# Altium project DAC_Expansion_Board_Project.PrjPcb
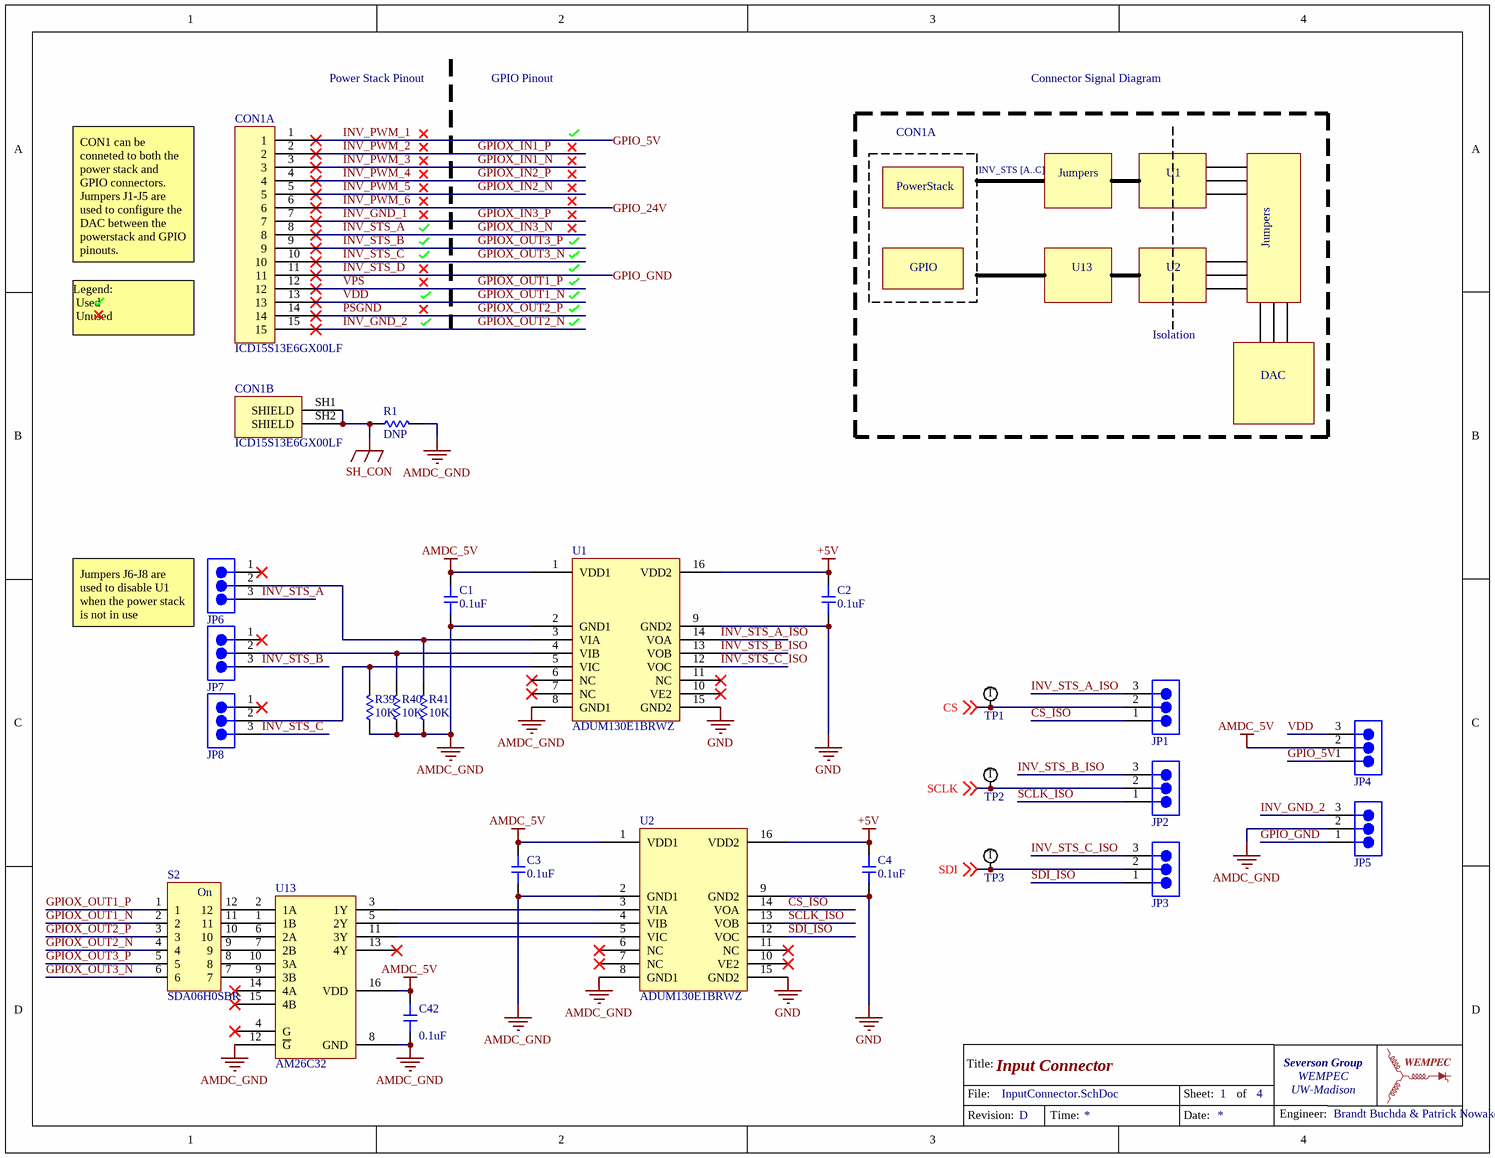
[diagram p0: InputConnector.SchDoc]
ProjectGroup: Severson Group; ProjectOrganization: WEMPEC; ProjectRev: D; ProjectUniversity: UW-Madison
4 sheets, 138 parts. Net scope: global (net labels, ports and power ports of the same name join across sheets).
Board file: PCB.PcbDoc
Sheets:
  InputConnector.SchDoc
  DAC.SchDoc
  OutputConnectors.SchDoc
  BackPage.SchDoc

## Sheet InputConnector.SchDoc: Input Connector
size Letter; Engineer: Brandt Buchda & Patrick Nowakowski; Revision: C; SheetTotal: 4; SheetNumber: 1

### Parts
C1  value 0.1uF  [0603-CAP]  (hidden comment: CC0603KRX7R8BB104)
C2  value 0.1uF  [0603-CAP]  (hidden comment: CC0603KRX7R8BB104)
C3  value 0.1uF  [0603-CAP]  (hidden comment: CC0603KRX7R8BB104)
C4  value 0.1uF  [0603-CAP]  (hidden comment: CC0603KRX7R8BB104)
C42  value 0.1uF  [0603-CAP]  (hidden comment: CC0603KRX7R8BB104)
CON1  ICD15S13E6GX00LF  [ICD15S13E6GX00LF]  (parts A,B of 2)
JP1  TSW-103-07-F-S  [PIN_HEADER_1X3]  (value not drawn)
JP2  TSW-103-07-F-S  [PIN_HEADER_1X3]  (value not drawn)
JP3  TSW-103-07-F-S  [PIN_HEADER_1X3]  (value not drawn)
JP4  TSW-103-07-F-S  [PIN_HEADER_1X3]  (value not drawn)
JP5  TSW-103-07-F-S  [PIN_HEADER_1X3]  (value not drawn)
JP6  TSW-103-07-F-S  [PIN_HEADER_1X3]  (value not drawn)
JP7  TSW-103-07-F-S  [PIN_HEADER_1X3]  (value not drawn)
JP8  TSW-103-07-F-S  [PIN_HEADER_1X3]  (value not drawn)
R1  value DNP  [0603-RES]  (hidden comment: Resistor)  (no BOM)
R39  value 10K  [0603-RES]  (hidden comment: ERJ-PB3B1002V)
R40  value 10K  [0603-RES]  (hidden comment: ERJ-PB3B1002V)
R41  value 10K  [0603-RES]  (hidden comment: ERJ-PB3B1002V)
S2  SDA06H0SBR  [SDA06H0SBR]
TP1  Test Point  [RCU-0C]  (value not drawn)
TP2  Test Point  [RCU-0C]  (value not drawn)
TP3  Test Point  [RCU-0C]  (value not drawn)
U1  ADUM130E1BRWZ  [SOIC127P1030X265-16N]
U2  ADUM130E1BRWZ  [SOIC127P1030X265-16N]
U13  AM26C32  [TSOP65P640X120-16N]

### Nets
+5V: C2.2 C4.2 U1.16(VDD2) U2.16(VDD2)
AMDC_5V: C1.2 C3.2 C42.2 JP4.2 U1.1(VDD1) U2.1(VDD1) U13.16(VDD)
AMDC_GND: C1.1 C3.1 C42.1 JP5.2 R1.2 R39.1 R40.1 R41.1 U1.2(GND1) U1.8(GND1) U2.2(GND1) U2.8(GND1) U13.8(GND) U13.12(~{G})
GND: C2.1 C4.1 U1.9(GND2) U1.15(GND2) U2.9(GND2) U2.15(GND2)
SH_CON: CON1.SH1(SHIELD) CON1.SH2(SHIELD) R1.1
CS: JP1.2 TP1.1 ; off-sheet CS
CS_ISO: JP1.1 U2.14(VOA)
GPIO_5V: CON1.1 JP4.1  [also labelled INV_PWM_1]
GPIO_24V: CON1.6  [also labelled INV_PWM_6]
GPIO_GND: CON1.11 JP5.1  [also labelled INV_STS_D]
GPIOX_IN1_N: CON1.3  [also labelled INV_PWM_3]
GPIOX_IN1_P: CON1.2  [also labelled INV_PWM_2]
GPIOX_IN2_N: CON1.5  [also labelled INV_PWM_5]
GPIOX_IN2_P: CON1.4  [also labelled INV_PWM_4]
GPIOX_IN3_N: CON1.8 JP6.3  [also labelled INV_STS_A]
GPIOX_IN3_P: CON1.7  [also labelled INV_GND_1]
GPIOX_OUT1_N: CON1.13 JP4.3 S2.2  [also labelled VDD]
GPIOX_OUT1_P: CON1.12 S2.1  [also labelled VPS]
GPIOX_OUT2_N: CON1.15 JP5.3 S2.4  [also labelled INV_GND_2]
GPIOX_OUT2_P: CON1.14 S2.3  [also labelled PSGND]
GPIOX_OUT3_N: CON1.10 JP8.3 S2.6  [also labelled INV_STS_C]
GPIOX_OUT3_P: CON1.9 JP7.3 S2.5  [also labelled INV_STS_B]
INV_STS_A_ISO: JP1.3 U1.14(VOA)
INV_STS_B_ISO: JP2.3 U1.13(VOB)
INV_STS_C_ISO: JP3.3 U1.12(VOC)
SCLK: JP2.2 TP2.1 ; off-sheet SCLK
SCLK_ISO: JP2.1 U2.13(VOB)
SDI: JP3.2 TP3.1 ; off-sheet SDI
SDI_ISO: JP3.1 U2.12(VOC)
NetJP6_2: JP6.2 R41.2 U1.3(VIA)
NetJP7_2: JP7.2 R40.2 U1.4(VIB)
NetJP8_2: JP8.2 R39.2 U1.5(VIC)
NetS2_7: S2.7 U13.9(3B)
NetS2_8: S2.8 U13.10(3A)
NetS2_9: S2.9 U13.7(2B)
NetS2_10: S2.10 U13.6(2A)
NetS2_11: S2.11 U13.1(1B)
NetS2_12: S2.12 U13.2(1A)
NetU2_3: U2.3(VIA) U13.3(1Y)
NetU2_4: U2.4(VIB) U13.5(2Y)
NetU2_5: U2.5(VIC) U13.11(3Y)

Not connected (* = marked no-connect by the designer): JP6 1(76)*; JP7 1(76)*; JP8 1(76)*; U1 6(NC)* 7(NC)* 10(VE2)* 11(NC)*; U2 6(NC)* 7(NC)* 10(VE2)* 11(NC)*; U13 4(G)* 13(4Y)* 14(4A)* 15(4B)*

### Notes on the sheet
- Power Stack Pinout
- GPIO Pinout
- Connector Signal Diagram
- CON1A
- PowerStack
- INV_STS [A..C]
- Jumpers
- U1
- CON1 can be conneted to both the power stack and GPIO connectors. Jumpers J1-J5 are used to configure the DAC between the powerstack and GPIO pinouts.
- GPIO
- U13
- U2
- Legend:
  Used
  Unused
- Isolation
- DAC
- Jumpers J6-J8 are used to disable U1 when the power stack is not in use
- Title:
- File:
- Sheet:
- of
- Revision:
- Time:
- Date:
- Engineer:
- (in symbol SDA06H0SBR) On
- (in symbol Test Point) T

### Library data of the parts
C1-C4 C42 = Capacitor 0.1uF: 0.1µF ±10% 25V Ceramic Capacitor X7R 0603 (1608 Metric); Supplier 1: Digi-Key; Supplier Part Number 1: 311-1341-1-ND
CON1 = ICD15S13E6GX00LF: 15 Position D-Sub, High Density Receptacle, Female Sockets Connector; Supplier Part Number 1: 609-2801-ND; Supplier 1: Digi-Key
JP1-JP8 = TSW-103-07-F-S: Connector Header Through Hole 3 position 0.100" (2.54mm); Supplier 1: Digi-Key; Supplier Part Number 1: SAM8995-ND
R1 = Resistor: DNP; Supplier 1: Digi-Key
R39-R41 = Resistor 10K: 10 kOhms ±0.1% 0.2W, 1/5W Chip Resistor 0603 (1608 Metric) Automotive AEC-Q200, Pulse Withstanding Thick Film; Supplier 1: Digi-Key; Supplier Part Number 1: P20086CT-ND
S2 = SDA06H0SBR: SWITCH SLIDE DIP SPST 25MA 24V; Supplier 1: Digi-Key; Supplier Part Number 1: CKN9495CT-ND
TP1-TP3 = Test Point: Material - Insulation: No Insulation; Supplier Part Number: *; Supplier: *; Footprint: *; Supplier 1: Digi-Key; RoHS: RoHS Compliant; Category: Test and Measurement; Stock 1: 136646; Pricing 1: 1=0.22, 10=0.206, 25=0.1756, 50=0.1536, 100=0.1426, 250=0.12616, 500=0.12068, 1000=0.09874 (USD); Packaging: Cut Tape (CT); Part Status: Active; Type: PC Test Point; Mounting Type: Surface Mount; Color: Natural; Size / Dimension: 0.063" x 0.031" x 0.045" (1.60mm x 0.80mm x 1.15mm); Plating: -; Material - Body: -; ComponentLink1URL: http://www.te.com/commerce/DocumentDelivery/DDEController?Action=srchrtrv&DocNm=1773266&DocType=DS&DocLang=English; ComponentLink1Description: http://www.te.com/commerce/DocumentDelivery/DDEController?Action=srchrtrv&DocNm=1773266&DocType=DS&DocLang=English; Supplier Part Number 1: A106145CT-ND
U1 U2 = ADUM130E1BRWZ: General Purpose Digital Isolator 3750Vrms 3 Channel 150Mbps 75kV/µs CMTI 16-SOIC (0.295", 7.50mm Width); Supplier 1: Digi-Key; Supplier Part Number 1: ADUM130E1BRWZ-ND
U13 = AM26C32: IC RCVR RS422 QUAD DIFF 16TSSOP; Supplier 1: Digi-Key; Supplier Part Number 1: 296-30088-1-ND

## Sheet DAC.SchDoc: DAC
size Letter; Engineer: Brandt Buchda; SheetNumber: 2; SheetTotal: 4
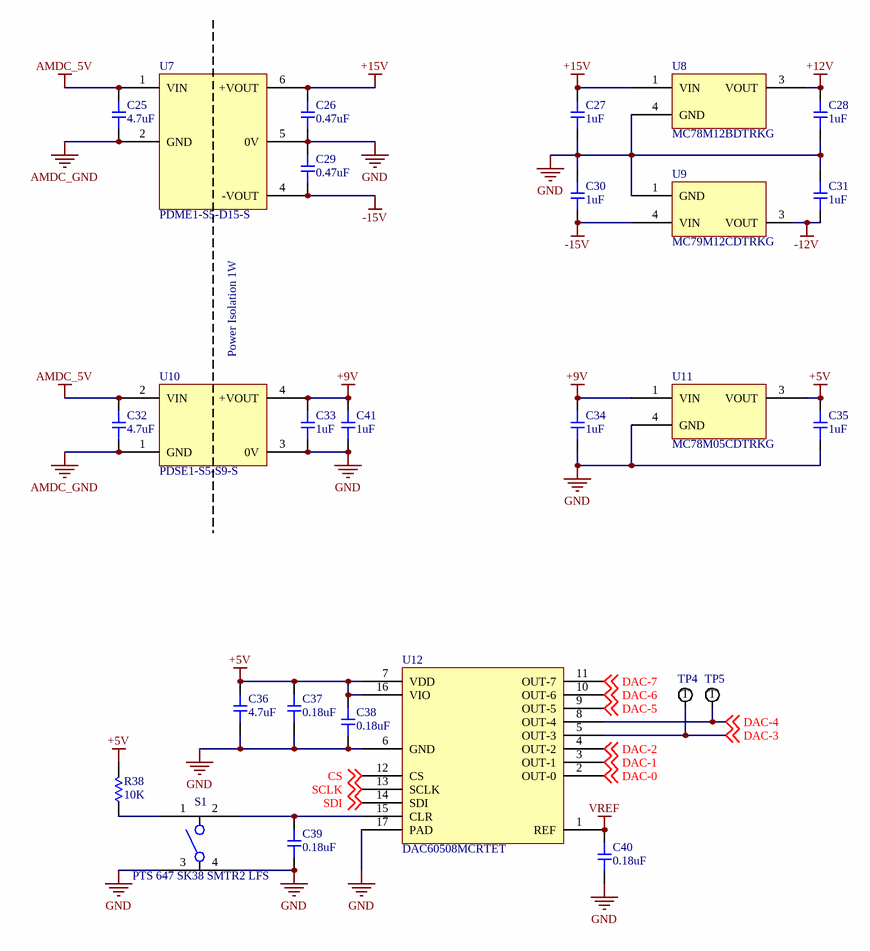
[diagram p1: DAC.SchDoc]

### Parts
C25  value 4.7uF  [0603-CAP]  (hidden comment: CL10A475KA8NQNC)
C26  value 0.47uF  [0603-CAP]  (hidden comment: CL10B474KO8NNNC)
C27  value 1uF  [0603-CAP]  (hidden comment: CL10A105KP8NNNC)
C28  value 1uF  [0603-CAP]  (hidden comment: CL10A105KP8NNNC)
C29  value 0.47uF  [0603-CAP]  (hidden comment: CL10B474KO8NNNC)
C30  value 1uF  [0603-CAP]  (hidden comment: CL10A105KP8NNNC)
C31  value 1uF  [0603-CAP]  (hidden comment: CL10A105KP8NNNC)
C32  value 4.7uF  [0603-CAP]  (hidden comment: CL10A475KA8NQNC)
C33  value 1uF  [0603-CAP]  (hidden comment: CL10A105KP8NNNC)
C34  value 1uF  [0603-CAP]  (hidden comment: CL10A105KP8NNNC)
C35  value 1uF  [0603-CAP]  (hidden comment: CL10A105KP8NNNC)
C36  value 4.7uF  [0603-CAP]  (hidden comment: CL10A475KA8NQNC)
C37  value 0.18uF  [0603-CAP]  (hidden comment: CC0603KRX7R7BB184)
C38  value 0.18uF  [0603-CAP]  (hidden comment: CC0603KRX7R7BB184)
C39  value 0.18uF  [0603-CAP]  (hidden comment: CC0603KRX7R7BB184)
C40  value 0.18uF  [0603-CAP]  (hidden comment: CC0603KRX7R7BB184)
C41  value 1uF  [0603-CAP]  (hidden comment: CL10A105KP8NNNC)
R38  value 10K  [0603-RES]  (hidden comment: ERJ-PB3B1002V)
S1  PTS 647 SK38 SMTR2 LFS  [PTS647SK38SMTR2LFSCT-ND]
TP4  Test Point  [RCU-0C]  (value not drawn)
TP5  Test Point  [RCU-0C]  (value not drawn)
U7  PDME1-S5-D15-S  [PDME1-S5-D15-S]
U8  MC78M12BDTRKG  [DPAK229P991X238-3N]
U9  MC79M12CDTRKG  [DPAK229P991X238-3N]
U10  PDSE1-S5-S9-S  [PDSE1-S5-S9-S]
U11  MC78M05CDTRKG  [DPAK229P991X238-3N]
U12  DAC60508MCRTET  [QFN50P300X300X80_HS-17N]

### Nets
+5V: C35.2 C36.2 C37.2 C38.2 R38.2 U11.3(VOUT) U12.7(VDD) U12.16(VIO)
+9V: C33.2 C34.2 C41.2 U10.4(+VOUT) U11.1(VIN)
+12V: C28.2 U8.3(VOUT)
+15V: C26.2 C27.2 U7.6(+VOUT) U8.1(VIN)
-12V: C31.1 U9.3(VOUT)
-15V: C29.1 C30.1 U7.4(-VOUT) U9.4(VIN)
AMDC_5V: C25.2 C32.2 U7.1(VIN) U10.2(VIN)
AMDC_GND: C25.1 C32.1 U7.2(GND) U10.1(GND)
GND: C26.1 C27.1 C28.1 C29.2 C30.2 C31.2 C33.1 C34.1 C35.1 C36.1 C37.1 C38.1 C39.1 C40.1 C41.1 S1.3 S1.4 U7.5(0V) U8.4(GND) U9.1(GND) U10.3(0V) U11.4(GND) U12.6(GND) U12.17(PAD)
VREF: C40.2 U12.1(REF)
CS: U12.12(CS) ; off-sheet CS
DAC-0: U12.2(OUT-0) ; off-sheet DAC-0
DAC-1: U12.3(OUT-1) ; off-sheet DAC-1
DAC-2: U12.4(OUT-2) ; off-sheet DAC-2
DAC-3: TP4.1 U12.5(OUT-3) ; off-sheet DAC-3
DAC-4: TP5.1 U12.8(OUT-4) ; off-sheet DAC-4
DAC-5: U12.9(OUT-5) ; off-sheet DAC-5
DAC-6: U12.10(OUT-6) ; off-sheet DAC-6
DAC-7: U12.11(OUT-7) ; off-sheet DAC-7
SCLK: U12.13(SCLK) ; off-sheet SCLK
SDI: U12.14(SDI) ; off-sheet SDI
NetC39_2: C39.2 S1.2 U12.15(CLR)
NetR38_1: R38.1 S1.1

### Notes on the sheet
- Power Isolation 1W
- Title:
- File:
- Sheet:
- of
- Revision:
- Time:
- Date:
- Engineer:
- (in symbol Test Point) T

### Library data of the parts
C25 C32 C36 = Capacitor 4.7uF: 4.7µF ±10% 25V Ceramic Capacitor X5R 0603 (1608 Metric); Supplier 1: Digi-Key; Supplier Part Number 1: 1276-1900-1-ND
C26 C29 = Capacitor .47uF: 0.47µF ±10% 16V Ceramic Capacitor X7R 0603 (1608 Metric); Supplier 1: Digi-Key; Supplier Part Number 1: 1276-1062-1-ND
C27 C28 C30 C31 C33-C35 C41 = Capacitor 1uF: 1µF ±10% 10V Ceramic Capacitor X5R 0603 (1608 Metric); Supplier 1: Digi-Key; Supplier Part Number 1: 1276-1182-1-ND
C37-C40 = Capacitor 0.18uF: 0.18µF ±10% 16V Ceramic Capacitor X7R 0603 (1608 Metric); Supplier 1: Digi-Key; Supplier Part Number 1: 311-4066-1-ND
R38 = Resistor 10K: as R39 on sheet InputConnector; Supplier 1: Digi-Key; Supplier Part Number 1: P20086CT-ND
S1 = PTS 647 SK38 SMTR2 LFS: Tactile Switch SPST-NO Top Actuated Surface Mount; Supplier 1: Digi-Key; Supplier Part Number 1: PTS647SK38SMTR2LFSCT-ND
TP4 TP5 = Test Point: Material - Insulation: No Insulation; Supplier Part Number: *; Supplier: *; Footprint: *; Supplier 1: Digi-Key; RoHS: RoHS Compliant; Category: Test and Measurement; Stock 1: 136646; Pricing 1: 1=0.22, 10=0.206, 25=0.1756, 50=0.1536, 100=0.1426, 250=0.12616, 500=0.12068, 1000=0.09874 (USD); Packaging: Cut Tape (CT); Part Status: Active; Type: PC Test Point; Mounting Type: Surface Mount; Color: Natural; Size / Dimension: 0.063" x 0.031" x 0.045" (1.60mm x 0.80mm x 1.15mm); Plating: -; Material - Body: -; ComponentLink1URL: http://www.te.com/commerce/DocumentDelivery/DDEController?Action=srchrtrv&DocNm=1773266&DocType=DS&DocLang=English; ComponentLink1Description: http://www.te.com/commerce/DocumentDelivery/DDEController?Action=srchrtrv&DocNm=1773266&DocType=DS&DocLang=English; Supplier Part Number 1: A106145CT-ND
U7 = PDME1-S5-D15-S: Isolated Module DC DC Converter 2 Output 15V -15V   34mA, 34mA 4.5V - 5.5V Input; Supplier 1: Digi-Key; Supplier Part Number 1: 102-6323-ND
U8 = MC78M12BDTRKG: +12 Linear Voltage Regulator IC  1 Output  500mA DPAK; Supplier 1: Digi-Key; Supplier Part Number 1: MC78M12BDTRKGOSCT-ND
U9 = MC79M12CDTRKG: -12 Linear Voltage Regulator IC  1 Output  500mA DPAK; Supplier 1: Digi-Key; Supplier Part Number 1: MC79M12CDTRKGOSCT-ND
U10 = PDSE1-S5-S9-S: Isolated Module DC DC Converter 1 Output 9V    111mA 4.5V - 5.5V Input; Supplier 1: Digi-Key; Supplier Part Number 1: 102-6292-ND
U11 = MC78M05CDTRKG: +5V Linear Voltage Regulator IC  1 Output  500mA DPAK; Supplier 1: Digi-Key; Supplier Part Number 1: MC78M05CDTRKGOSCT-ND
U12 = DAC60508MCRTET: 12 Bit Digital to Analog Converter 8 16-WQFN (3x3); Supplier 1: Digi-Key; Supplier Part Number 1: 296-52288-1-ND

## Sheet OutputConnectors.SchDoc: Output Connectors
size Letter; Engineer: Brandt Buchda & Patrick Nowakowski; SheetNumber: 3; SheetTotal: 4
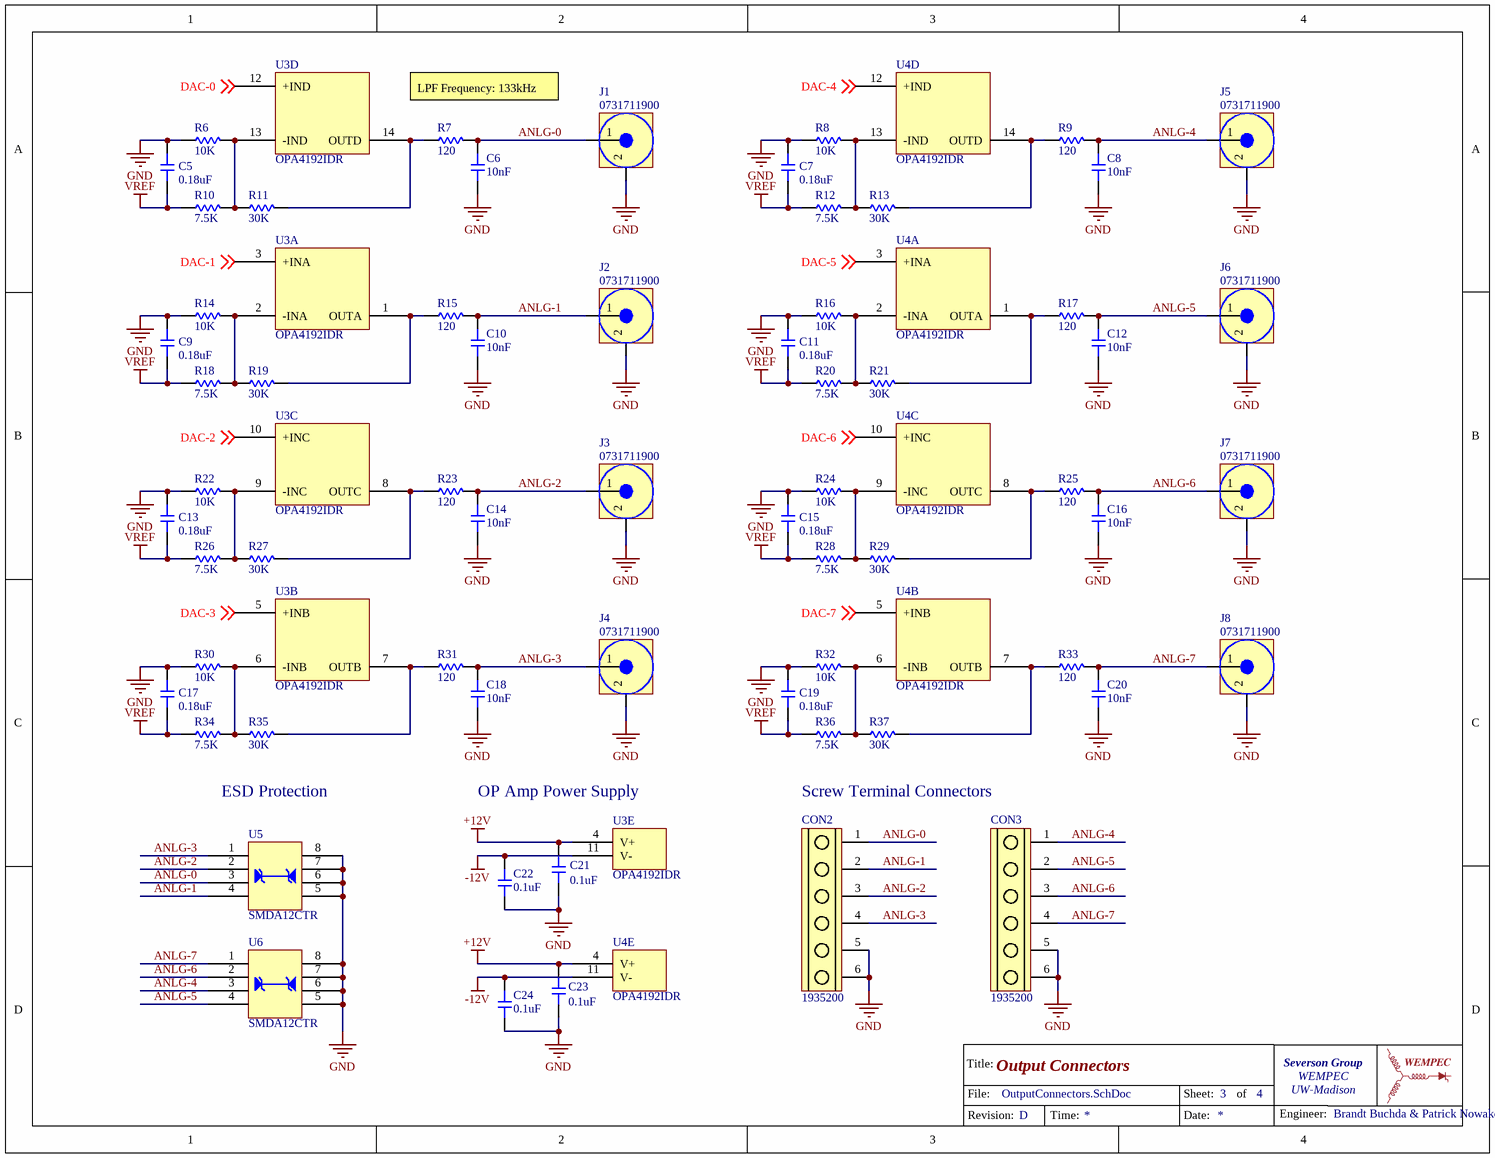
[diagram p2: OutputConnectors.SchDoc]

### Parts
C5  value 0.18uF  [0603-CAP]  (hidden comment: CC0603KRX7R7BB184)
C6  value 10nF  [0603-CAP]  (hidden comment: CC0603KRX7R9BB103)
C7  value 0.18uF  [0603-CAP]  (hidden comment: CC0603KRX7R7BB184)
C8  value 10nF  [0603-CAP]  (hidden comment: CC0603KRX7R9BB103)
C9  value 0.18uF  [0603-CAP]  (hidden comment: CC0603KRX7R7BB184)
C10  value 10nF  [0603-CAP]  (hidden comment: CC0603KRX7R9BB103)
C11  value 0.18uF  [0603-CAP]  (hidden comment: CC0603KRX7R7BB184)
C12  value 10nF  [0603-CAP]  (hidden comment: CC0603KRX7R9BB103)
C13  value 0.18uF  [0603-CAP]  (hidden comment: CC0603KRX7R7BB184)
C14  value 10nF  [0603-CAP]  (hidden comment: CC0603KRX7R9BB103)
C15  value 0.18uF  [0603-CAP]  (hidden comment: CC0603KRX7R7BB184)
C16  value 10nF  [0603-CAP]  (hidden comment: CC0603KRX7R9BB103)
C17  value 0.18uF  [0603-CAP]  (hidden comment: CC0603KRX7R7BB184)
C18  value 10nF  [0603-CAP]  (hidden comment: CC0603KRX7R9BB103)
C19  value 0.18uF  [0603-CAP]  (hidden comment: CC0603KRX7R7BB184)
C20  value 10nF  [0603-CAP]  (hidden comment: CC0603KRX7R9BB103)
C21  value 0.1uF  [0603-CAP]  (hidden comment: CC0603KRX7R8BB104)
C22  value 0.1uF  [0603-CAP]  (hidden comment: CC0603KRX7R8BB104)
C23  value 0.1uF  [0603-CAP]  (hidden comment: CC0603KRX7R8BB104)
C24  value 0.1uF  [0603-CAP]  (hidden comment: CC0603KRX7R8BB104)
CON2  1935200  [1935200]
CON3  1935200  [1935200]
J1  0731711900  [0731711900]
J2  0731711900  [0731711900]
J3  0731711900  [0731711900]
J4  0731711900  [0731711900]
J5  0731711900  [0731711900]
J6  0731711900  [0731711900]
J7  0731711900  [0731711900]
J8  0731711900  [0731711900]
R6  value 10K  [0603-RES]  (hidden comment: ERJ-PB3B1002V)
R7  value 120  [0603-RES]  (hidden comment: RC0603FR-07120RL)
R8  value 10K  [0603-RES]  (hidden comment: ERJ-PB3B1002V)
R9  value 120  [0603-RES]  (hidden comment: RC0603FR-07120RL)
R10  value 7.5K  [0603-RES]  (hidden comment: ERJ-PB3B7501V)
R11  value 30K  [0603-RES]  (hidden comment: ERJ-PB3B3002V)
R12  value 7.5K  [0603-RES]  (hidden comment: ERJ-PB3B7501V)
R13  value 30K  [0603-RES]  (hidden comment: ERJ-PB3B3002V)
R14  value 10K  [0603-RES]  (hidden comment: ERJ-PB3B1002V)
R15  value 120  [0603-RES]  (hidden comment: RC0603FR-07120RL)
R16  value 10K  [0603-RES]  (hidden comment: ERJ-PB3B1002V)
R17  value 120  [0603-RES]  (hidden comment: RC0603FR-07120RL)
R18  value 7.5K  [0603-RES]  (hidden comment: ERJ-PB3B7501V)
R19  value 30K  [0603-RES]  (hidden comment: ERJ-PB3B3002V)
R20  value 7.5K  [0603-RES]  (hidden comment: ERJ-PB3B7501V)
R21  value 30K  [0603-RES]  (hidden comment: ERJ-PB3B3002V)
R22  value 10K  [0603-RES]  (hidden comment: ERJ-PB3B1002V)
R23  value 120  [0603-RES]  (hidden comment: RC0603FR-07120RL)
R24  value 10K  [0603-RES]  (hidden comment: ERJ-PB3B1002V)
R25  value 120  [0603-RES]  (hidden comment: RC0603FR-07120RL)
R26  value 7.5K  [0603-RES]  (hidden comment: ERJ-PB3B7501V)
R27  value 30K  [0603-RES]  (hidden comment: ERJ-PB3B3002V)
R28  value 7.5K  [0603-RES]  (hidden comment: ERJ-PB3B7501V)
R29  value 30K  [0603-RES]  (hidden comment: ERJ-PB3B3002V)
R30  value 10K  [0603-RES]  (hidden comment: ERJ-PB3B1002V)
R31  value 120  [0603-RES]  (hidden comment: RC0603FR-07120RL)
R32  value 10K  [0603-RES]  (hidden comment: ERJ-PB3B1002V)
R33  value 120  [0603-RES]  (hidden comment: RC0603FR-07120RL)
R34  value 7.5K  [0603-RES]  (hidden comment: ERJ-PB3B7501V)
R35  value 30K  [0603-RES]  (hidden comment: ERJ-PB3B3002V)
R36  value 7.5K  [0603-RES]  (hidden comment: ERJ-PB3B7501V)
R37  value 30K  [0603-RES]  (hidden comment: ERJ-PB3B3002V)
U3  OPA4192IDR  [SOIC127P600X175-14N]  (parts A,B,C,D,E of 5)
U4  OPA4192IDR  [SOIC127P600X175-14N]  (parts A,B,C,D,E of 5)
U5  SMDA12CTR  [SOIC127P600X175-8N-B]
U6  SMDA12CTR  [SOIC127P600X175-8N-B]

### Nets
+12V: C21.2 C23.2 U3.4(V+) U4.4(V+)
-12V: C22.2 C24.2 U3.11(V-) U4.11(V-)
GND: C5.2 C6.1 C7.2 C8.1 C9.2 C10.1 C11.2 C12.1 C13.2 C14.1 C15.2 C16.1 C17.2 C18.1 C19.2 C20.1 C21.1 C22.1 C23.1 C24.1 CON2.5 CON2.6 CON3.5 CON3.6 J1.2(GND) J2.2(GND) J3.2(GND) J4.2(GND) J5.2(GND) J6.2(GND) J7.2(GND) J8.2(GND) R6.1 R8.1 R14.1 R16.1 R22.1 R24.1 R30.1 R32.1 U5.5 U5.6 U5.7 U5.8 U6.5 U6.6 U6.7 U6.8
VREF: C5.1 C7.1 C9.1 C11.1 C13.1 C15.1 C17.1 C19.1 R10.1 R12.1 R18.1 R20.1 R26.1 R28.1 R34.1 R36.1
ANLG-0: C6.2 CON2.1 J1.1(ANLG) R7.2 U5.3
ANLG-1: C10.2 CON2.2 J2.1(ANLG) R15.2 U5.4
ANLG-2: C14.2 CON2.3 J3.1(ANLG) R23.2 U5.2
ANLG-3: C18.2 CON2.4 J4.1(ANLG) R31.2 U5.1
ANLG-4: C8.2 CON3.1 J5.1(ANLG) R9.2 U6.3
ANLG-5: C12.2 CON3.2 J6.1(ANLG) R17.2 U6.4
ANLG-6: C16.2 CON3.3 J7.1(ANLG) R25.2 U6.2
ANLG-7: C20.2 CON3.4 J8.1(ANLG) R33.2 U6.1
DAC-0: U3.12(+IND) ; off-sheet DAC-0
DAC-1: U3.3(+INA) ; off-sheet DAC-1
DAC-2: U3.10(+INC) ; off-sheet DAC-2
DAC-3: U3.5(+INB) ; off-sheet DAC-3
DAC-4: U4.12(+IND) ; off-sheet DAC-4
DAC-5: U4.3(+INA) ; off-sheet DAC-5
DAC-6: U4.10(+INC) ; off-sheet DAC-6
DAC-7: U4.5(+INB) ; off-sheet DAC-7
NetR6_2: R6.2 R10.2 R11.1 U3.13(-IND)
NetR7_1: R7.1 R11.2 U3.14(OUTD)
NetR8_2: R8.2 R12.2 R13.1 U4.13(-IND)
NetR9_1: R9.1 R13.2 U4.14(OUTD)
NetR14_2: R14.2 R18.2 R19.1 U3.2(-INA)
NetR15_1: R15.1 R19.2 U3.1(OUTA)
NetR16_2: R16.2 R20.2 R21.1 U4.2(-INA)
NetR17_1: R17.1 R21.2 U4.1(OUTA)
NetR22_2: R22.2 R26.2 R27.1 U3.9(-INC)
NetR23_1: R23.1 R27.2 U3.8(OUTC)
NetR24_2: R24.2 R28.2 R29.1 U4.9(-INC)
NetR25_1: R25.1 R29.2 U4.8(OUTC)
NetR30_2: R30.2 R34.2 R35.1 U3.6(-INB)
NetR31_1: R31.1 R35.2 U3.7(OUTB)
NetR32_2: R32.2 R36.2 R37.1 U4.6(-INB)
NetR33_1: R33.1 R37.2 U4.7(OUTB)

### Notes on the sheet
- LPF Frequency: 133kHz
- ESD Protection
- OP Amp Power Supply
- Screw Terminal Connectors
- Title:
- File:
- Sheet:
- of
- Revision:
- Time:
- Date:
- Engineer:

### Library data of the parts
C5 C7 C9 C11 C13 C15 C17 C19 = Capacitor 0.18uF: as C37 on sheet DAC; Supplier 1: Digi-Key; Supplier Part Number 1: 311-4066-1-ND
C6 C8 C10 C12 C14 C16 C18 C20 = Capacitor 10nF: 10000pF ±10% 50V Ceramic Capacitor X7R 0603 (1608 Metric); Supplier 1: Digi-Key; Supplier Part Number 1: 311-1085-1-ND
C21-C24 = Capacitor 0.1uF: as C1 on sheet InputConnector; Supplier 1: Digi-Key; Supplier Part Number 1: 311-1341-1-ND
CON2 CON3 = 1935200: 6 Position Wire to Board Terminal Block Horizontal with Board 0.197" (5.00mm) Through Hole; Supplier 1: Digi-Key; Supplier Part Number 1: 277-1581-ND
J1-J8 = 0731711900: CONN BNC JACK STR 75 OHM PCB; Supplier 1: Digi-Key; Supplier Part Number 1: WM5517-ND
R6 R8 R14 R16 R22 R24 R30 R32 = Resistor 10K: as R39 on sheet InputConnector; Supplier 1: Digi-Key; Supplier Part Number 1: P20086CT-ND
R7 R9 R15 R17 R23 R25 R31 R33 = Resistor 120: 120 Ohms ±1% 0.1W, 1/10W Chip Resistor 0603 (1608 Metric) Moisture Resistant Thick Film; Supplier 1: Digi-Key; Supplier Part Number 1: 311-120HRCT-ND
R10 R12 R18 R20 R26 R28 R34 R36 = Resistor 7.5K: 7.5 kOhms ±0.1% 0.2W, 1/5W Chip Resistor 0603 (1608 Metric) Automotive AEC-Q200, Pulse Withstanding Thick Film; Supplier 1: Digi-Key; Supplier Part Number 1: P20072CT-ND
R11 R13 R19 R21 R27 R29 R35 R37 = Resistor 30K: 30 kOhms ±0.1% 0.2W, 1/5W Chip Resistor 0603 (1608 Metric) Automotive AEC-Q200, Pulse Withstanding Thick Film; Supplier 1: Digi-Key; Supplier Part Number 1: P20138CT-ND
U3 U4 = OPA4192IDR: General Purpose Amplifier 4 Circuit Rail-to-Rail 14-SOIC; Supplier 1: Digi-Key; Supplier Part Number 1: 296-43159-1-ND
U5 U6 = SMDA12CTR: 19V Clamp 1A (8/20µs) Ipp TVS Diode Surface Mount 8-SO. No common node.; Supplier 1: Digi-Key; Supplier Part Number 1: 1655-1701-1-ND

## Sheet BackPage.SchDoc: Back Page
size Letter; Engineer: Brandt Buchda; SheetNumber: 4; SheetTotal: 4
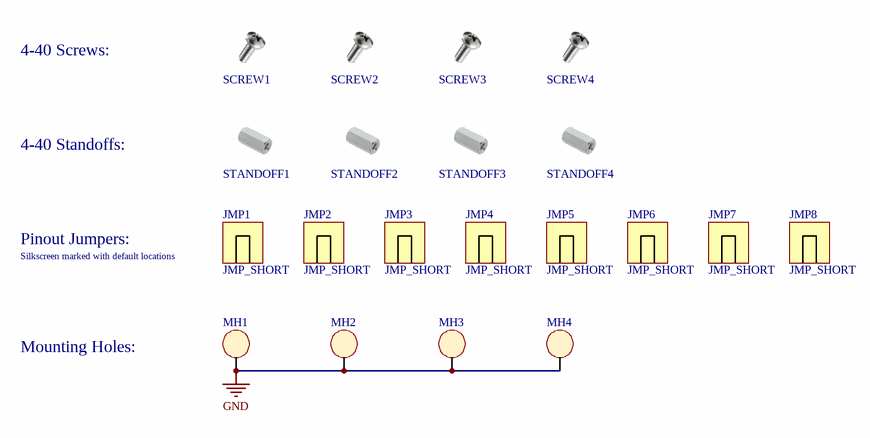
[diagram p3: BackPage.SchDoc]

### Parts
JMP1  JMP_SHORT  (mechanical)
JMP2  JMP_SHORT  (mechanical)
JMP3  JMP_SHORT  (mechanical)
JMP4  JMP_SHORT  (mechanical)
JMP5  JMP_SHORT  (mechanical)
JMP6  JMP_SHORT  (mechanical)
JMP7  JMP_SHORT  (mechanical)
JMP8  JMP_SHORT  (mechanical)
MH1  MOUNT_HOLE  [MOUNTING_HOLE]  (value not drawn)  (no BOM)
MH2  MOUNT_HOLE  [MOUNTING_HOLE]  (value not drawn)  (no BOM)
MH3  MOUNT_HOLE  [MOUNTING_HOLE]  (value not drawn)  (no BOM)
MH4  MOUNT_HOLE  [MOUNTING_HOLE]  (value not drawn)  (no BOM)
SCREW1  9900  (value not drawn)  (mechanical)
SCREW2  9900  (value not drawn)  (mechanical)
SCREW3  9900  (value not drawn)  (mechanical)
SCREW4  9900  (value not drawn)  (mechanical)
STANDOFF1  2057-440-AL-7  (value not drawn)  (mechanical)
STANDOFF2  2057-440-AL-7  (value not drawn)  (mechanical)
STANDOFF3  2057-440-AL-7  (value not drawn)  (mechanical)
STANDOFF4  2057-440-AL-7  (value not drawn)  (mechanical)

### Nets
GND: MH1.1 MH2.1 MH3.1 MH4.1

### Notes on the sheet
- 4-40 Screws:
- 4-40 Standoffs:
- Pinout Jumpers:
- (near JMP1) Silkscreen marked with default locations
- Mounting Holes:
- Title:
- File:
- Sheet:
- of
- Revision:
- Time:
- Date:
- Engineer:

### Library data of the parts
JMP1-JMP8 = JUMPER_SHORT: CONN JUMPER SHORTING .100" GOLD; Supplier 1: Digi-Key; Supplier Part Number 1: S9337-ND
MH1-MH4 = MOUNT_HOLE: MOUNTING HOLE
SCREW1-SCREW4 = SCREW 4-40: #4-40 Pan Head Machine Screw Phillips Drive Stainless Steel; Supplier 1: Digi-Key; Supplier Part Number 1: 36-9900-ND
STANDOFF1-STANDOFF4 = Standoff 4-40: Hex Standoff Threaded #4-40 Aluminum 0.500" (12.70mm) 1/2"; Supplier 1: Digi-Key; Supplier Part Number 1: 1772-1993-ND

## Nets that join several sheets
+5V: InputConnector (C2.2 C4.2 U1.16 U2.16), DAC (8 pins)
+12V: DAC (C28.2 U8.3), OutputConnectors (C21.2 C23.2 U3.4 U4.4)
-12V: DAC (C31.1 U9.3), OutputConnectors (C22.2 C24.2 U3.11 U4.11)
AMDC_5V: InputConnector (7 pins), DAC (C25.2 C32.2 U7.1 U10.2)
AMDC_GND: InputConnector (14 pins), DAC (C25.1 C32.1 U7.2 U10.1)
GND: InputConnector (6 pins), DAC (24 pins), OutputConnectors (48 pins), BackPage (MH1.1 MH2.1 MH3.1 MH4.1)
VREF: DAC (C40.2 U12.1), OutputConnectors (16 pins)
CS: InputConnector (JP1.2 TP1.1), DAC (U12.12)
DAC-0: DAC (U12.2), OutputConnectors (U3.12)
DAC-1: DAC (U12.3), OutputConnectors (U3.3)
DAC-2: DAC (U12.4), OutputConnectors (U3.10)
DAC-3: DAC (TP4.1 U12.5), OutputConnectors (U3.5)
DAC-4: DAC (TP5.1 U12.8), OutputConnectors (U4.12)
DAC-5: DAC (U12.9), OutputConnectors (U4.3)
DAC-6: DAC (U12.10), OutputConnectors (U4.10)
DAC-7: DAC (U12.11), OutputConnectors (U4.5)
SCLK: InputConnector (JP2.2 TP2.1), DAC (U12.13)
SDI: InputConnector (JP3.2 TP3.1), DAC (U12.14)